# EAGLE schematic OSSM_Main_PCB (EAGLE 9.6.2)
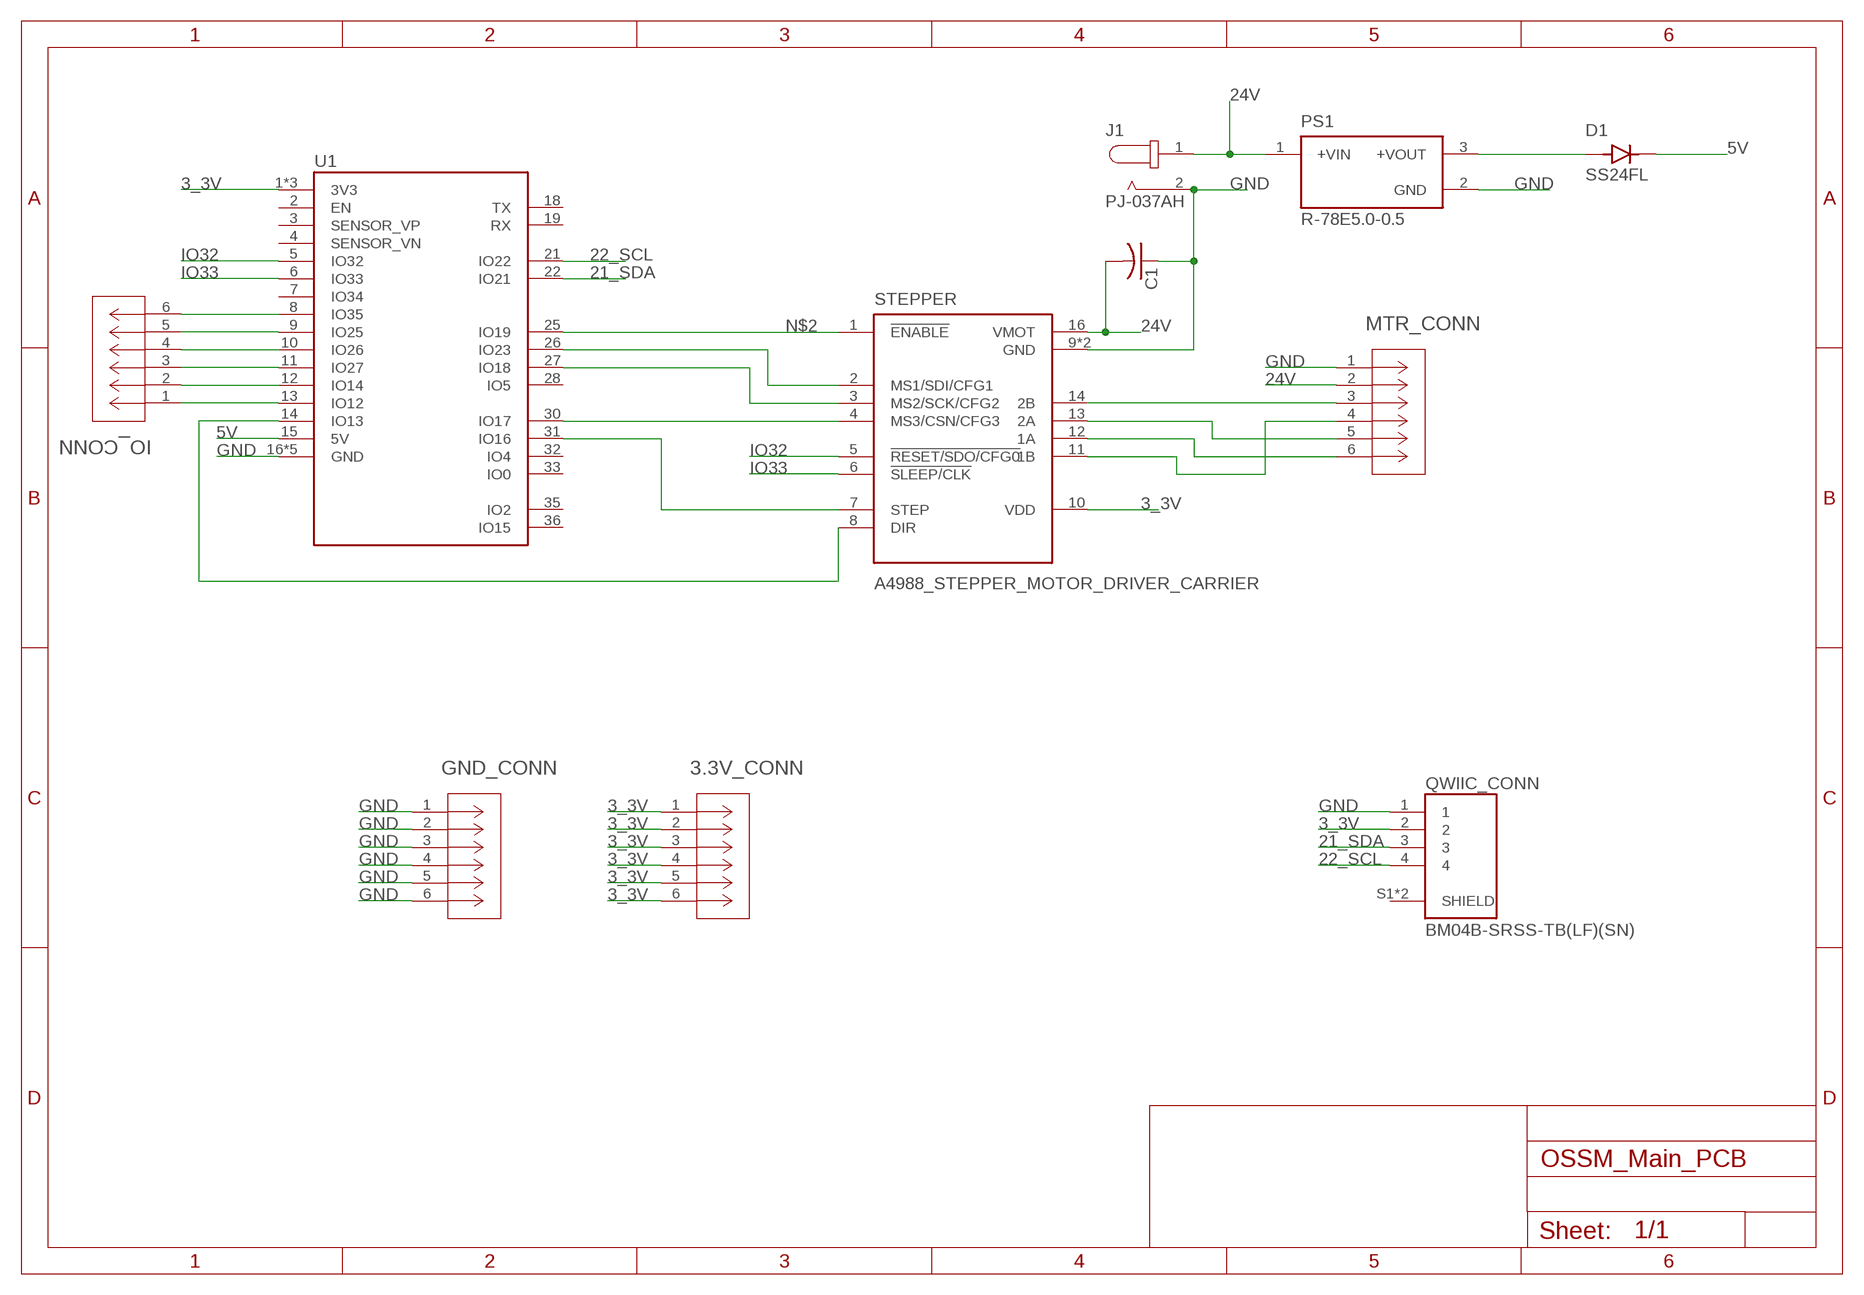
[diagram p0: schematic, sheet 1]

## Parts
3.3V_CONN  1792902  [CONN_1792902_PXC]
C1  C-US050-024X044  [C050-024X044]
D1  SS24FL  [SODFL3617X108N]
GND_CONN  1792902  [CONN_1792902_PXC]
IO_CONN  1792902  [CONN_1792902_PXC]
J1  PJ-037AH  [CUI_PJ-037AH]
MTR_CONN  1792902  [CONN_1792902_PXC]
PS1  R-78E5.0-0.5  [CONV_R-78E5.0-0.5]
QWIIC_CONN  BM04B-SRSS-TB(LF)(SN)  [CONN_BM04B-SRSS-TB(LF)(SN)]
STEPPER  A4988_STEPPER_MOTOR_DRIVER_CARRIER  [MODULE_A4988_STEPPER_MOTOR_DRIVER_CARRIER]
U1  LOLIN32_PRODUCTION  [LOLIN32_PRODUCTION]

## Nets
3_3V: 3.3V_CONN.1 3.3V_CONN.2 3.3V_CONN.3 3.3V_CONN.4 3.3V_CONN.5 3.3V_CONN.6 QWIIC_CONN.2 STEPPER.10(VDD) U1.1(3V3) U1.20(3V3) U1.29(3V3)
5V: D1.C U1.15(5V)
21_SDA: QWIIC_CONN.3 U1.22(IO21)
22_SCL: QWIIC_CONN.4 U1.21(IO22)
24V: C1.2 J1.1 MTR_CONN.2 PS1.1(+VIN) STEPPER.16(VMOT)
GND: C1.1 GND_CONN.1 GND_CONN.2 GND_CONN.3 GND_CONN.4 GND_CONN.5 GND_CONN.6 J1.2 MTR_CONN.1 PS1.2(GND) QWIIC_CONN.1 STEPPER.9(GND) STEPPER.15(GND) U1.16(GND) U1.17(GND) U1.23(GND) U1.24(GND) U1.34(GND)
IO32: STEPPER.5(!RESET/SDO/CFG0) U1.5(IO32)
IO33: STEPPER.6(!SLEEP/CLK) U1.6(IO33)
N$1: D1.A PS1.3(+VOUT)
N$2: STEPPER.1(!ENABLE) U1.25(IO19)
N$3: STEPPER.2(MS1/SDI/CFG1) U1.26(IO23)
N$4: STEPPER.3(MS2/SCK/CFG2) U1.27(IO18)
N$5: STEPPER.4(MS3/CSN/CFG3) U1.30(IO17)
N$6: STEPPER.7(STEP) U1.31(IO16)
N$7: STEPPER.8(DIR) U1.14(IO13)
N$8: MTR_CONN.6 STEPPER.12(1A)
N$9: MTR_CONN.5 STEPPER.13(2A)
N$10: MTR_CONN.4 STEPPER.11(1B)
N$11: MTR_CONN.3 STEPPER.14(2B)
N$12: IO_CONN.1 U1.13(IO12)
N$13: IO_CONN.2 U1.12(IO14)
N$14: IO_CONN.3 U1.11(IO27)
N$15: IO_CONN.4 U1.10(IO26)
N$16: IO_CONN.5 U1.9(IO25)
N$17: IO_CONN.6 U1.8(IO35)
Unconnected: QWIIC_CONN.S1(SHIELD) QWIIC_CONN.S2(SHIELD) U1.2(EN) U1.3(SENSOR_VP) U1.4(SENSOR_VN) U1.7(IO34) U1.18(TX) U1.19(RX) U1.28(IO5) U1.32(IO4) U1.33(IO0) U1.35(IO2) U1.36(IO15)

## Library data of the parts
3.3V_CONN GND_CONN IO_CONN MTR_CONN = @DT-TRAINER:1792902; ARTICLE_DESCRIPTION: PTS 1,5/ 6-5,0-H; BUILT_BY: EMA_Cory; CONTACT_TYPE: Unknown; COPYRIGHT: Copyright (C) 2018 Accelerated Designs. All rights reserved; MANUFACTURER_PART_NUMBER: 1792902; NUMBER_OF_CONNECTION: 6; NUMBER_OF_POSITION_PER_ROW: 6; NUMBER_OF_POTENTIALS: 6; NUMBER_OF_ROWS: 1; NUMBER_OF_SOLDER_PINS_PER_POTENTIALS: 1; PITCH__MM_: 5; PLUG_SYSTEM: Unknown; PRODUCTTYP: Printed circuit board terminal; PRODUCT_FAMILY: PTS 1,5/..-H; SOLDER_PIN_LENGTH__MM_: 2.5; SOURCELIBRARY: Phoenix_Contact_2020-03-19; VENDOR: Phoenix Contact
C1 = rcl:C-US: CAPACITOR, American symbol; SPICEPREFIX: C
D1 = SS24FL:SS24FL: Diode Schottky Barrier Rectifier 30V 1A 2-Pin SOD-123F T/R; DESCRIPTION: Diode Schottky 40V 2A Surface Mount SOD-123F; DIGI-KEY_PART_NUMBER: SS24FLCT-ND; MF: ON Semiconductor; MP: SS24FL; PACKAGE: SOD-123 FL-2 ON Semiconductor; PURCHASE-URL: https://pricing.snapeda.com/search/part/SS24FL/?ref=eda
J1 = PJ-037AH:PJ-037AH: 2.0 x 6.5 mm, 5.0 A, Horizontal, Through Hole, Dc Power Jack Connector; MANUFACTURER: CUI Devices; MAXIMUM_PACKAGE_HEIGHT: 11.2 mm; PARTREV: 1.05; STANDARD: Manufacturer Recommendations
PS1 = R-78E5.0-0.5:R-78E5.0-0.5: 0.5 Amp SIP3 Single Output; DESCRIPTION: Switching regulator module - DC/DC converter . Single Output. 7.0V to 28.0V input voltage range and 5 V output voltage range; DIGI-KEY_PART_NUMBER: 945-1648-5-ND; MF: Recom Power; MP: R-78E5.0-0.5; PACKAGE: SIP-3 Recom Power; PURCHASE-URL: https://pricing.snapeda.com/search/part/R-78E5.0-0.5/?ref=eda
QWIIC_CONN = BM04B-SRSS-TB_LF__SN_:BM04B-SRSS-TB(LF)(SN): BM04B Series 1 mm Pitch 4 Position SMT Single Row Top Entry Shrouded Header; DESCRIPTION: Connector Header Surface Mount 4 position 0.039 (1.00mm); DIGI-KEY_PART_NUMBER: 455-1790-1-ND; MF: JST Sales; MP: BM04B-SRSS-TB(LF)(SN); PACKAGE: None; PURCHASE-URL: https://pricing.snapeda.com/search/part/BM04B-SRSS-TB(LF)(SN)/?ref=eda
STEPPER = A4988_STEPPER_MOTOR_DRIVER_CARRIER:A4988_STEPPER_MOTOR_DRIVER_CARRIER: Stepper motor controler; IC: A4988; 1A; Uin mot: 8÷35V; AVAILABILITY: Unavailable; DESCRIPTION: Stepper Motor Driver; MF: Pololu; MP: A4988 STEPPER MOTOR DRIVER CARRIER; PACKAGE: None; PRICE: None
U1 = $DT-TRAINER:LOLIN32_PRODUCTION: Eval Board For Esp-Wroom-32